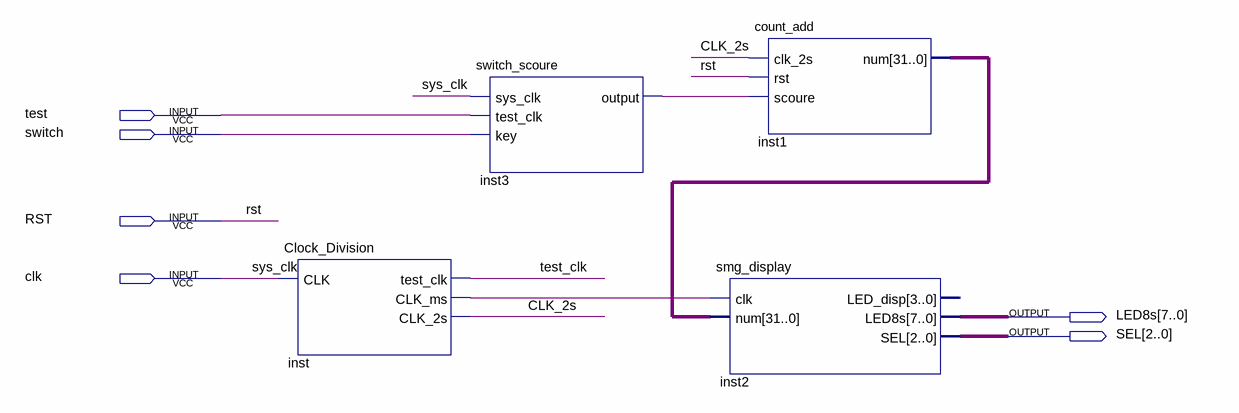
[diagram p0: schematic sheet]
// Quartus schematic mea.bdf as structural Verilog: 4 symbols, 6 pins
module mea (
  input  test,
  input  switch,
  input  RST,
  input  clk,
  output [7:0] LED8s,
  output [2:0] SEL
);

  wire CLK_2s, inst3_output, inst_clk_ms, test_clk;
  wire [31:0] inst1_num;

  Clock_Division inst (.CLK(clk), .test_clk(test_clk), .CLK_ms(inst_clk_ms), .CLK_2s(CLK_2s));
  switch_scoure inst3 (.sys_clk(clk), .test_clk(test), .key(switch), .\output (inst3_output));
  count_add inst1 (.clk_2s(CLK_2s), .rst(RST), .scoure(inst3_output), .num(inst1_num));
  smg_display inst2 (.clk(inst_clk_ms), .num(inst1_num), .LED8s(LED8s), .SEL(SEL));  // open: LED_disp

  // Other names for the same wires on the sheet: sys_clk = clk
endmodule
